# Altium schematic sheet Schematic.schdoc
size 297 x 209 mm; Symbol: Drawing-Symbol_A4; @Project Name: Anirban-s-Bicycle-Taillight; @Page Count: 1; @Update Date: 2026-09-04; @Create Date: 2026-09-04; @Schematic Name: Schematic1; @Page No: 1; @Page Name: P1; Company: EasyEDA.com; Version: V1.0; Page Size: A4; Device: Drawing-Symbol_A4; @Create Time: 11:02:27; @Update Time: 11:02:27; Border: 1; Width: 1170; Height: 825; Region Start: 1; X Region Count: 6; Y Region Count: 4; Blade Width: 10; Title Block Position: 3; @Board Name: Board1
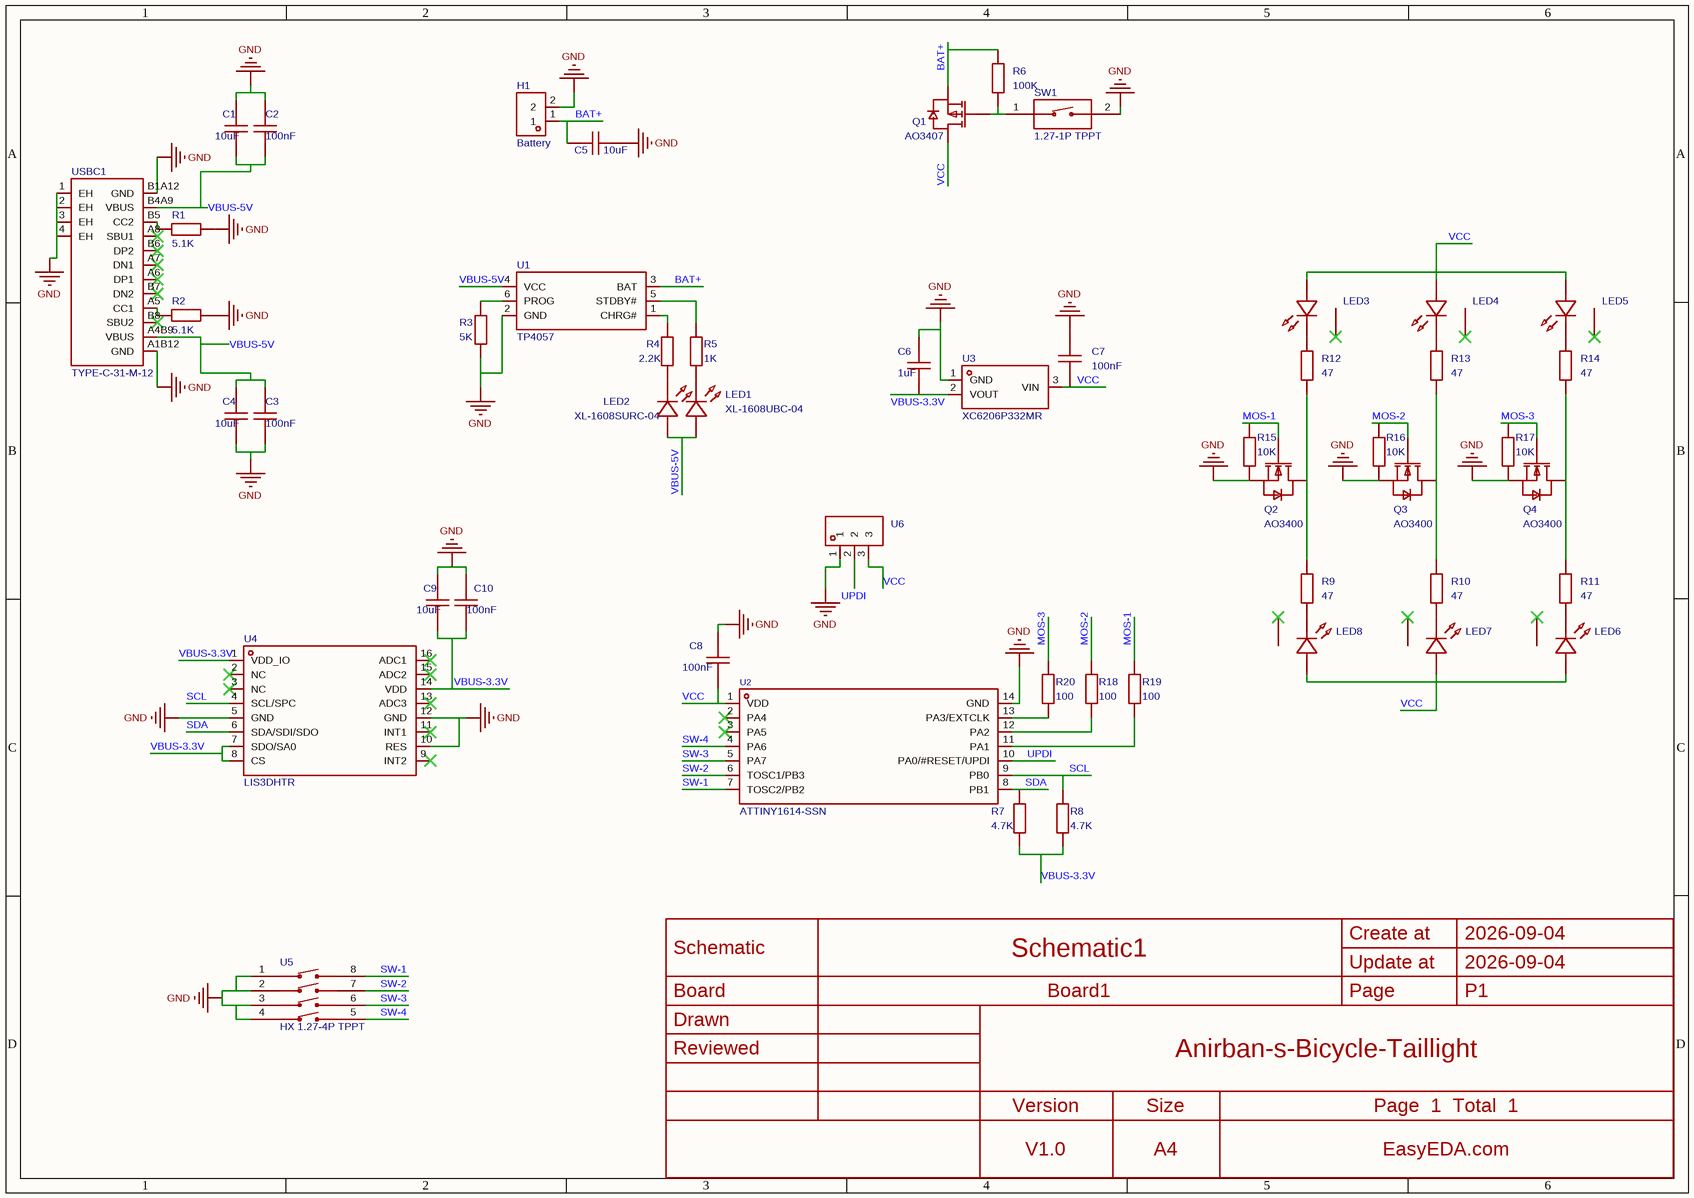
[diagram p0: Schematic.schdoc]

## Parts
C1  10uF  [C0603]
C2  100nF  [C0603]
C3  100nF  [C0603]
C4  10uF  [C0603]
C5  10uF  [C0603]
C6  1uF  [C0603]
C7  100nF  [C0603]
C8  100nF  [C0603]
C9  10uF  [C0603]
C10  100nF  [C0603]
H1  Battery  [HDR-TH_2P-P2.54-V-M]
LED1  XL-1608UBC-04  [LED0603-RD_BLUE]
LED2  XL-1608SURC-04  [LED0603-RD]
LED3  XL-5730SURC-05  [LED-SMD_XL-5730SURC-05]  (value not drawn)
LED4  XL-5730SURC-05  [LED-SMD_XL-5730SURC-05]  (value not drawn)
LED5  XL-5730SURC-05  [LED-SMD_XL-5730SURC-05]  (value not drawn)
LED6  XL-5730SURC-05  [LED-SMD_XL-5730SURC-05]  (value not drawn)
LED7  XL-5730SURC-05  [LED-SMD_XL-5730SURC-05]  (value not drawn)
LED8  XL-5730SURC-05  [LED-SMD_XL-5730SURC-05]  (value not drawn)
Q1  AO3407  [SOT-23-3_L2.9-W1.3-P1.90-LS2.4-BR]
Q2  AO3400  [SOT-23-3_L2.9-W1.3-P1.90-LS2.4-BR]
Q3  AO3400  [SOT-23-3_L2.9-W1.3-P1.90-LS2.4-BR]
Q4  AO3400  [SOT-23-3_L2.9-W1.3-P1.90-LS2.4-BR]
R1  value 5.1K  [R0603]
R2  value 5.1K  [R0603]
R3  5K  [R0603]
R4  2.2K  [R0603]
R5  1K  [R0603]
R6  100K  [R0603]
R7  4.7K  [R0603]
R8  4.7K  [R0603]
R9  47  [R0603]
R10  47  [R0603]
R11  47  [R0603]
R12  47  [R0603]
R13  47  [R0603]
R14  47  [R0603]
R15  10K  [R0603]
R16  10K  [R0603]
R17  10K  [R0603]
R18  100  [R0603]
R19  100  [R0603]
R20  100  [R0603]
SW1  1.27-1P TPPT  [SW-SMD_1.27-1P-TPPT]
U1  TP4057  [SOT-23-6_L2.9-W1.6-P0.95-LS2.9-BL]
U2  ATTINY1614-SSN  [SOIC-14_L8.7-W3.9-P1.27-LS6.0-BL]
U3  XC6206P332MR  [SOT-23-3_L2.9-W1.6-P1.90-LS2.8-BR]
U4  LIS3DHTR  [LGA-16_L3.0-W3.0-P0.50-TL]
U5  HX 1.27-4P TPPT  [SW-SMD_8P-P1.27-L6.7-W5.4]
U6  黄色排针A_HEADER3  [HDR-TH_3P-P2.54-V-M-1]  (value not drawn)
USBC1  TYPE-C-31-M-12  [USB-C_SMD-TYPE-C-31-M-12_1]

## Nets
GND: C1.1 C2.1 C3.1 C4.1 C5.2 C6.1 C7.1 C8.1 C9.1 C10.1 H1.2 Q2.2(S) Q3.2(S) Q4.2(S) R1.2 R2.2 R3.1 R15.1 R16.1 R17.1 SW1.2 U1.2(GND) U2.14(GND) U3.1(GND) U4.5(GND) U4.10(RES) U4.12(GND) U5.1 U5.2 U5.3 U5.4 U6.1 USBC1.1(EH) USBC1.2(EH) USBC1.3(EH) USBC1.4(EH) USBC1.A1B12(GND) USBC1.B1A12(GND)
BAT+: C5.1 H1.1 Q1.2(S) R6.2 U1.3(BAT)
MOS-1: Q2.1(G) R15.2 R19.2
MOS-2: Q3.1(G) R16.2 R18.2
MOS-3: Q4.1(G) R17.2 R20.2
SCL: R8.2 U2.9(PB0) U4.4(SCL/SPC)
SDA: R7.2 U2.8(PB1) U4.6(SDA/SDI/SDO)
SW-1: U2.7(TOSC2/PB2) U5.8
SW-2: U2.6(TOSC1/PB3) U5.7
SW-3: U2.5(PA7) U5.6
SW-4: U2.4(PA6) U5.5
UPDI: U2.10(PA0/#RESET/UPDI) U6.2
VBUS-3.3V: C6.2 C9.2 C10.2 R7.1 R8.1 U3.2(VOUT) U4.1(VDD_IO) U4.7(SDO/SA0) U4.8(CS) U4.14(VDD)
VBUS-5V: C1.2 C2.2 C3.2 C4.2 LED1.2(A) LED2.2(A) U1.4(VCC) USBC1.A4B9(VBUS) USBC1.B4A9(VBUS)
VCC: C7.2 C8.2 LED3.1 LED4.1 LED5.1 LED6.1 LED7.1 LED8.1 Q1.3(D) U2.1(VDD) U3.3(VIN) U6.3
NetLED1_1: LED1.1(K) R5.1
NetLED2_1: LED2.1(K) R4.1
NetLED3_2: LED3.2 R12.2
NetLED4_2: LED4.2 R13.2
NetLED5_2: LED5.2 R14.2
NetLED6_2: LED6.2 R11.1
NetLED7_2: LED7.2 R10.1
NetLED8_2: LED8.2 R9.1
NetQ1_1: Q1.1(G) R6.1 SW1.1
NetQ2_3: Q2.3(D) R9.2 R12.1
NetQ3_3: Q3.3(D) R10.2 R13.1
NetQ4_3: Q4.3(D) R11.2 R14.1
NetR1_1: R1.1 USBC1.B5(CC2)
NetR2_1: R2.1 USBC1.A5(CC1)
NetR3_2: R3.2 U1.6(PROG)
NetR4_2: R4.2 U1.1(CHRG#)
NetR5_2: R5.2 U1.5(STDBY#)
NetR18_1: R18.1 U2.12(PA2)
NetR19_1: R19.1 U2.11(PA1)
NetR20_1: R20.1 U2.13(PA3/EXTCLK)

Not connected (* = marked no-connect by the designer): LED3 3*; LED4 3*; LED5 3*; LED6 3*; LED7 3*; LED8 3*; U2 2(PA4)* 3(PA5)*; U4 2(NC)* 3(NC)* 9(INT2)* 11(INT1)* 13(ADC3)* 15(ADC2)* 16(ADC1)*; USBC1 A6(DP1)* A7(DN1)* A8(SBU1)* B6(DP2)* B7(DN2)* B8(SBU2)*

## Notes on the sheet
- Create at
- 2026-09-04
- Schematic
- Board
- Schematic1
- Board1
- Update at
- Page
- P1
- Drawn
- Reviewed
- Anirban-s-Bicycle-Taillight
- Version
- V1.0
- Size
- A4
- Page  1  Total  1
- EasyEDA.com

## Library data of the parts
C1-C4 = CAP_0603: Symbol: CAP_OLD; ConvertToPcb: yes; ModelId: 624118aa3cc7497086c383c2d72e08520819f05c4eef4c71ace90d822a990e87; ModelName: C0603_L1.6-W0.8-H0.8; ModelTransform: 62.992,31.496,0,0,0,0,0,0,0; Device: CAP_0603; AddInBom: yes; Supplier Footprint: 0603; FootprintName: C0603
  C1 C4: Value: 10uF
  C2 C3: Value: 100nF
C5-C10 = CAP_0603: Symbol: CAP_OLD; 3D Model: 624118aa3cc7497086c383c2d72e08520819f05c4eef4c71ace90d822a990e87; 3D Model Transform: 62.992,31.496,0,0,0,0,0,0,0; ConvertToPcb: yes; ModelName: C0603_L1.6-W0.8-H0.8; Device: CAP_0603; Supplier Footprint: 0603; AddInBom: yes; FootprintName: C0603
  C5 C9: Value: 10uF
  C6: Value: 1uF
  C7 C8 C10: Value: 100nF
H1 = PZ254V-11-02P: Pin Structure:1x2P Pitch:2.54mm Row Spacing:- Circluar Pins/Square Pins:Pin Header Mounting Type:Through Hole Number of Rows:1 Number of Pins:2P Current Rating:3A Voltage Rating (Max):250V Length of Mating Pin:6mm Insulation Height:2.5mm Length of End Con; Manufacturer: XFCN(兴飞); AddInBom: yes; ModelId: b9a02bffb1e248eabf92e8e2aa859dc00819f05c4eef4c71ace90d822a990e87; ModelName: HDR2.54-M-LI-1X2P; ModelTransform: 200,100,0,0,0,0,0,0,-118.11; Pin Structure: 1x2P; Pitch: 2.54mm; Current Rating: 3A; Voltage Rating (Max): 250V; Symbol: PZ254V-11-02P; Device: PZ254V-11-02P; Manufacturer Part: Battery; LCSC Part Name: 1x2P 间距:2.54mm 方针 直插; SupplierPart: C492401; Supplier Footprint: 插件,P=2.54mm; JLCPCB Part Class: Extended Part; Datasheet: https://item.szlcsc.com/datasheet/PZ254V-11-02P/502957.html; Supplier: LCSC; ConvertToPcb: yes; FootprintName: HDR-TH_2P-P2.54-V-M; Row Spacing: -; Circluar Pins/Square Pins: Pin Header; Mounting Type: Through Hole; Number of Rows: 1; Number of Pins: 2P; Length of Mating Pin: 6mm; Insulation Height: 2.5mm; Length of End Connection Pin: 3mm; Contact Material: Brass; Contact Plating: -; Operating Temperature: -40℃~+105℃; Color: Black
LED1 = XL-1608UBC-04: Lamp Holder Type:1.6mm x 0.8mm square LED Illumination Color:Blue Voltage - Forward(Vf):3.3V Voltage - Forward(Vf):3.3V Power(Watts):70mW Forward Current:20mA Wavelength - Dominant:455nm~475nm Wavelength - Dominant:455nm~475nm Peak Wavelength:470nm Peak W; Manufacturer: XINGLIGHT(成兴光); AddInBom: yes; ModelId: c855dcfa3bed47718ab34fb5ca38c90d0819f05c4eef4c71ace90d822a990e87; ModelTransform: 63.7794,31.496,0,0,0,0,0,0.002,0; Illumination Color: Blue; Voltage - Forward(Vf): 3.3V; Power(Watts): 70mW; Forward Current: 20mA; Peak Wavelength: 470nm; Diode Configuration: Discrete Diode; Lens Color: Water Clear; Luminous Intensity: 300mcd; Viewing Angle: 120°; Symbol: XL-1608UBC-04; Device: XL-1608UBC-04; LCSC Part Name: 0603蓝色贴片式发光二极管; SupplierPart: C965807; ManufacturerPart: XL-1608UBC-04; Supplier Footprint: 0603; JLCPCB Part Class: Extended Part; Datasheet: https://item.szlcsc.com/datasheet/XL-1608UBC-04/1051416.html; Supplier: LCSC; ConvertToPcb: yes; FootprintName: LED0603-RD_BLUE; ModelName: LED0603-RD_BLUE; Lamp Holder Type: 1.6mm x 0.8mm square LED; Wavelength - Dominant: 455nm~475nm; Color Temperature: -; Mounting Style: Top-mount; Operating Temperature: -40℃~+85℃
LED2 = XL-1608SURC-04: Lamp Holder Type:1.6mm x 0.8mm square LED Illumination Color:Red Voltage - Forward(Vf):2.4V Voltage - Forward(Vf):2.4V Power(Watts):50mW Forward Current:20mA Wavelength - Dominant:620nm~625nm Wavelength - Dominant:620nm~625nm Peak Wavelength:625nm Peak Wa; Manufacturer: XINGLIGHT(成兴光); AddInBom: yes; ModelId: 5e3b568068dd46cf8019c1d1baa0031b0819f05c4eef4c71ace90d822a990e87; ModelTransform: 63.7794,32.283,0,0,0,0,0,0,0; Illumination Color: Red; Voltage - Forward(Vf): 2.4V; Power(Watts): 50mW; Forward Current: 20mA; Peak Wavelength: 625nm; Diode Configuration: Discrete Diode; Lens Color: Water Clear; Luminous Intensity: 120mcd; Viewing Angle: 120°; Symbol: XL-1608SURC-04; Device: XL-1608SURC-04; LCSC Part Name: 0603红色贴片式发光二极管; SupplierPart: C965798; ManufacturerPart: XL-1608SURC-04; Supplier Footprint: 0603; JLCPCB Part Class: Extended Part; Datasheet: https://item.szlcsc.com/datasheet/XL-1608SURC-04/1051407.html; Supplier: LCSC; ConvertToPcb: yes; FootprintName: LED0603-RD; ModelName: LED0603-RD; Lamp Holder Type: 1.6mm x 0.8mm square LED; Wavelength - Dominant: 620nm~625nm; Color Temperature: -; Mounting Style: Top-mount; Operating Temperature: -40℃~+85℃
LED3-LED8 = XL-5730SURC-05: Lamp Holder Type:5.7mmx3.0mm方形灯头 Illumination Color:Red Voltage - Forward(Vf):2.4V Voltage - Forward(Vf):2.4V Power(Watts):500mW Forward Current:150mA Wavelength - Dominant:620nm~630nm Wavelength - Dominant:620nm~630nm Peak Wavelength:625nm Peak Wavelengt; Manufacturer: XINGLIGHT(成兴光); AddInBom: yes; ModelId: baeed070cb034912b15d57249944bc550819f05c4eef4c71ace90d822a990e87; ModelTransform: 224.409,118.11,0,0,0,0,0,0,0; Illumination Color: Red; Voltage - Forward(Vf): 2.4V; Power(Watts): 500mW; Forward Current: 150mA; Peak Wavelength: 625nm; Diode Configuration: Discrete Diode; Lens Color: Water Clear; Viewing Angle: 120°; Symbol: XL-5730SURC-05; Device: XL-5730SURC-05; LCSC Part Name: 贴片式发光二极管; SupplierPart: C2843883; ManufacturerPart: XL-5730SURC-05; Supplier Footprint: SMD5730-3P; JLCPCB Part Class: Extended Part; Datasheet: https://item.szlcsc.com/datasheet/XL-5730SURC-05/3033184.html; Supplier: LCSC; ConvertToPcb: yes; FootprintName: LED-SMD_XL-5730SURC-05; ModelName: LED-SMD_XL-5730SURC-05; Lamp Holder Type: 5.7mmx3.0mm方形灯头; Wavelength - Dominant: 620nm~630nm; Color Temperature: -; Luminous Intensity: -; Mounting Style: Top-mount; Operating Temperature: -20℃~+80℃
Q1 = AO3407_C54863558: Manufacturer: SEP(威旺); AddInBom: yes; ModelId: 62a57c6760504a01965db6419a6d07df0819f05c4eef4c71ace90d822a990e87; ModelName: SOT-23-3P_L2.9-W1.3-H1.0-LS2.4-P0.95; ModelTransform: 98.425,114.173,0,180,0,0,0.0005,-0.0005,0; Symbol: AO3407_C54863558; Device: AO3407_C54863558; LCSC Part Name: AO3407; SupplierPart: C54863558; ManufacturerPart: AO3407; Supplier Footprint: SOT-23; JLCPCB Part Class: Extended Part; Datasheet: https://item.szlcsc.com/datasheet/AO3407/58359818.html; Supplier: LCSC; ConvertToPcb: yes; FootprintName: SOT-23-3_L2.9-W1.3-P1.90-LS2.4-BR
Q2-Q4 = AO3400_C51315085: Number:1 N-channel Drain to Source Voltage:30V Current - Continuous Drain(Id):5.8A RDS(on):35mΩ@10V Pd - Power Dissipation:350mW Gate Threshold Voltage (Vgs(th)):1.4V Gate Charge(Qg):- Input Capacitance(Ciss):1.05nF Reverse Transfer Capacitance (Crss@Vds); Manufacturer: CBI(创基); AddInBom: yes; ModelId: 62a57c6760504a01965db6419a6d07df0819f05c4eef4c71ace90d822a990e87; ModelName: SOT-23-3P_L2.9-W1.3-H1.0-LS2.4-P0.95; ModelTransform: 98.425,114.173,0,180,0,0,0.0005,-0.0005,0; Drain to Source Voltage: 30V; Current - Continuous Drain(Id): 5.8A; Pd - Power Dissipation: 350mW; Gate Threshold Voltage (Vgs(th)): 1.4V; Input Capacitance(Ciss): 1.05nF; Reverse Transfer Capacitance (Crss@Vds): 77pF; Output Capacitance(Coss): 99pF; Vgs: ±12V; Symbol: AO3400_C51315085; Device: AO3400_C51315085; LCSC Part Name: SOT-23封装N沟道增强型场效应塑料封装MOSFET，高密单元设计，低导通电阻，具备出色导通电阻和最大直流电流能力; SupplierPart: C51315085; ManufacturerPart: AO3400; Supplier Footprint: SOT-23; JLCPCB Part Class: Extended Part; Datasheet: https://item.szlcsc.com/datasheet/AO3400/53967173.html; Supplier: LCSC; ConvertToPcb: yes; FootprintName: SOT-23-3_L2.9-W1.3-P1.90-LS2.4-BR; Number: 1 N-channel; RDS(on): 35mΩ@10V; Gate Charge(Qg): -; Operating Temperature: -; Configuration: -; Type: N-Channel
R1-R5 = Res_0603: Symbol: Res; ConvertToPcb: yes; ModelId: 112863783b5b41f1b5254f87eedc79320819f05c4eef4c71ace90d822a990e87; ModelTransform: 31.8897,63.7794,0,90,0,0,0,0,0; Device: Res_0603; AddInBom: yes; Supplier Footprint: 0603; FootprintName: R0603; ModelName: R0603
  R3: Value: 5K
  R4: Value: 2.2K
  R5: Value: 1K
R6-R20 = Res_0603: Symbol: Res; 3D Model: 112863783b5b41f1b5254f87eedc79320819f05c4eef4c71ace90d822a990e87; 3D Model Transform: 31.8897,63.7794,0,90,0,0,0,0,0; ConvertToPcb: yes; Device: Res_0603; Supplier Footprint: 0603; AddInBom: yes; FootprintName: R0603; ModelName: R0603
  R6: Value: 100K
  R7 R8: Value: 4.7K
  R9-R14: Value: 47
  R15-R17: Value: 10K
  R18-R20: Value: 100
SW1 = 1.27-1P TPPT: Type:Slide, Recessed Circuit:SPST Number of Positions:1 Termination Style:Gull Wing Lead Pitch:1.27mm Current Rating:25mA Voltage Rating:24V Operating Temperature:-30℃~+85℃ Operating Temperature:-30℃~+85℃ Operating Life:2,000 cycles Color:Black; Manufacturer: SHOU HAN(首韩); AddInBom: yes; ModelId: 38b659ad1ea6435a942904584f367d4a0819f05c4eef4c71ace90d822a990e87; ModelTransform: 112.9919,328.7395,0,0,0,0,0,0,0; Circuit: SPST; Number of Positions: 1; Current Rating: 25mA; Voltage Rating: 24V; Symbol: 1.27-1P TPPT; Device: 1.27-1P TPPT; LCSC Part Name: 1.27-1P贴片平推有LOGO贴膜编带; SupplierPart: C6386918; ManufacturerPart: 1.27-1P TPPT; Supplier Footprint: SMD,P=1.27mm; JLCPCB Part Class: Extended Part; Datasheet: https://item.szlcsc.com/datasheet/1.27-1P%2520TPPT/7337475.html; Supplier: LCSC; ConvertToPcb: yes; FootprintName: SW-SMD_1.27-1P-TPPT; ModelName: SW-SMD_1.27-1P-TPPT; Type: Slide, Recessed; Termination Style: Gull Wing; Lead Pitch: 1.27mm; Operating Temperature: -30℃~+85℃; Operating Life: 2,000 cycles; Color: Black
U1 = TP4057_C18198383: The Chip Type:Charging IC Voltage - Supply:4.25V~6.5V Voltage - Supply:4.25V~6.5V Charge Current - Max:500mA Charging Saturation Voltage:4.2V End-Off Voltage:- Type of Battery:Lithium Battery Number of Cells:1 Number of Cells:1 Operating Temperature:-40℃~; Manufacturer: HXY MOSFET(华轩阳电子); AddInBom: yes; ModelId: 2643a280c6074a1bbaee88508a1815ee0819f05c4eef4c71ace90d822a990e87; ModelTransform: 114.173,114.173,0,0,0,0,0,0,0; Charge Current - Max: 500mA; Charging Saturation Voltage: 4.2V; Number of Cells: 1; Battery Temperature Detection: Not supported; Supply Current (Iq): 25uA; Symbol: TP4057_C18198383; Device: TP4057_C18198383; LCSC Part Name: 电池管理 500mA; SupplierPart: C18198383; ManufacturerPart: TP4057; Supplier Footprint: SOT-23-6L; JLCPCB Part Class: Extended Part; Datasheet: https://item.szlcsc.com/datasheet/TP4057/19350041.html; Supplier: LCSC; ConvertToPcb: yes; FootprintName: SOT-23-6_L2.9-W1.6-P0.95-LS2.9-BL; ModelName: SOT-23-6_L2.9-W1.6-P0.95-LS2.9-BL; The Chip Type: Charging IC; Voltage - Supply: 4.25V~6.5V; End-Off Voltage: -; Type of Battery: Lithium Battery; Operating Temperature: -40℃~+85℃; 0V Battery Charge: Not supported; Balance Current: -; Interface: -; Features: Constant voltage charging；Constant current charging；Automatic recharge；Charge termination；Soft start；Programmable charging current；Undervoltage lockout；Trickle charging
U2 = ATTINY1614-SSN_C614832: CPU Core:AVR CPU Maximum Speed:20MHz Program Storage Size:16KB Number of I/O:12 ADC (Bit):10bit DAC (Bit):8bit Voltage - Supply:1.8V~5.5V Voltage - Supply:1.8V~5.5V Applications:-; Manufacturer: MICROCHIP(美国微芯); AddInBom: yes; ModelId: 4a4abff9a5634443a503282266e866970819f05c4eef4c71ace90d822a990e87; ModelName: SOIC-14_L8.6-W3.9-H1.8-LS6.0-P1.27; ModelTransform: 338.583,236.22,0,0,0,0,0,0.001,0; CPU Core: AVR; CPU Maximum Speed: 20MHz; Program Storage Size: 16KB; Number of I/O: 12; ADC (Bit): 10bit; DAC (Bit): 8bit; Symbol: ATTINY1614-SSN_C614832; Device: ATTINY1614-SSN_C614832; Supplier: LCSC; Supplier Part: C614832; Manufacturer Part: ATTINY1614-SSN; JLCPCB Part Class: Extended Part; LCSC Part Name: ATTINY1614-SSN; Supplier Footprint: SOIC-14; Datasheet: https://item.szlcsc.com/datasheet/ATTINY1614-SSN/644840.html; ConvertToPcb: yes; FootprintName: SOIC-14_L8.7-W3.9-P1.27-LS6.0-BL; Voltage - Supply: 1.8V~5.5V; Applications: -
U3 = XC6206P332MR_C51886221: Output Configuration:Positive Voltage - Supply:6V Output Voltage:3.3V Output Voltage:3.3V Output Current:100mA Power Supply Rejection Ratio (PSRR):45dB@(1kHz) Voltage Dropout:160mV@(50mA) standby current:6uA Noise:- Features:Over Current Protection；Therma; Manufacturer: TECH PUBLIC(台舟); AddInBom: yes; ModelId: 4eed685bb9f4439b846746bc2193f3c00819f05c4eef4c71ace90d822a990e87; ModelName: SOT-23-3L_L2.9-W1.6-H1.1-LS2.8-P0.95; ModelTransform: 114.173,110.236,0,90,0,0,0,0,0; Voltage - Supply: 6V; Output Voltage: 3.3V; Output Current: 100mA; standby current: 6uA; Output Type: Fixed; Number of Outputs: 1; Symbol: XC6206P332MR_C51886221; Device: XC6206P332MR_C51886221; LCSC Part Name: 3.3V 6V; SupplierPart: C51886221; ManufacturerPart: XC6206P332MR; Supplier Footprint: SOT-23; JLCPCB Part Class: Extended Part; Datasheet: https://item.szlcsc.com/datasheet/XC6206P332MR/54557107.html; Supplier: LCSC; ConvertToPcb: yes; FootprintName: SOT-23-3_L2.9-W1.6-P1.90-LS2.8-BR; Output Configuration: Positive; Power Supply Rejection Ratio (PSRR): 45dB@(1kHz); Voltage Dropout: 160mV@(50mA); Noise: -; Features: Over Current Protection；Thermal shutdown; Operating Temperature: -40℃~+125℃
U4 = LIS3DHTR: Accelerometer Sensing Axis:X,Y,Z Acceleration Measurement Range (MAX):±16g Acceleration Measurement Range (MAX):±16g Gyroscope Sensing Axis:- Gyroscope Measurement Range (MAX):- Gyroscope Measurement Range (MAX):- Sensor Type:Accelerometer Output Bits:16b; Manufacturer: ST(意法半导体); Symbol: LIS3DHTR_C15134; AddInBom: yes; ModelId: 4f77563cd9cf46379f45c1990dd6f43a0819f05c4eef4c71ace90d822a990e87; ModelTransform: 118.11,118.11,0,0,0,0,0,0,0; Accelerometer Sensing Axis: X,Y,Z; Acceleration Measurement Range (MAX): ±16g; Output Bits: 16bit; Interface: I2C；SPI; Voltage - Supply: 1.71V~3.6V; Standby Current: 500nA; Device: LIS3DHTR; LCSC Part Name: MEMS数字输出运动传感器：超低功耗、高性能三轴加速度计; SupplierPart: C15134; ManufacturerPart: LIS3DHTR; Supplier Footprint: LGA-16(3x3); JLCPCB Part Class: Extended Part; Datasheet: https://item.szlcsc.com/datasheet/LIS3DHTR/15808.html; Supplier: LCSC; ConvertToPcb: yes; FootprintName: LGA-16_L3.0-W3.0-P0.50-TL; ModelName: LGA-16_L3.0-W3.0-P0.50-TL; Gyroscope Sensing Axis: -; Gyroscope Measurement Range (MAX): -; Sensor Type: Accelerometer; Cache Size: -; Operating Temperature: -40℃~+85℃; Features: Motion event detection
U5 = HX 1.27-4P TPPT: Type:Slide, Recessed Circuit:SPST Number of Positions:4 Termination Style:- Lead Pitch:1.27mm Current Rating:25mA Voltage Rating:24V Operating Temperature:-30℃~+85℃ Operating Temperature:-30℃~+85℃ Operating Life:2,000 Cycles Color:Black; Manufacturer: hanxia(韩下); AddInBom: yes; ModelId: 83c016bef41a4e07b861d37e08ddd85d0819f05c4eef4c71ace90d822a990e87; ModelTransform: 262.5979,328.7395,0,0,0,0,0.001,-0.003,0; Circuit: SPST; Number of Positions: 4; Current Rating: 25mA; Voltage Rating: 24V; Symbol: HX 1.27-4P TPPT; Device: HX 1.27-4P TPPT; LCSC Part Name: 拨码开关 贴片平拨 4位 1.27间距; SupplierPart: C7430300; ManufacturerPart: HX 1.27-4P TPPT; Supplier Footprint: SMD,P=1.27mm; JLCPCB Part Class: Extended Part; Datasheet: https://item.szlcsc.com/datasheet/HX%25201.27-4P%2520TPPT/8429924.html; Supplier: LCSC; ConvertToPcb: yes; FootprintName: SW-SMD_8P-P1.27-L6.7-W5.4; ModelName: SW-SMD_8P-P1.27-L6.7-W5.4; Type: Slide, Recessed; Termination Style: -; Lead Pitch: 1.27mm; Operating Temperature: -30℃~+85℃; Operating Life: 2,000 Cycles; Color: Black
U6 = 黄色排针A_HEADER3: AddInBom: yes; ModelId: 3b8cf4ff435f4f2b912293f2932d05980819f05c4eef4c71ace90d822a990e87; ModelName: HDR-M-2.54_1x3; ModelTransform: 299.9994,100,0,0,0,0,0,0,-118.11; Symbol: 黄色排针A_HEADER3; Device: 黄色排针A_HEADER3; LCSC Part Name: 黄色排针A_HEADER3; SupplierPart: C9900019266; ManufacturerPart: 黄色排针A_HEADER3; Supplier Footprint: HDR1X3_254M; JLCPCB Part Class: Extended Part; Supplier: LCSC; ConvertToPcb: yes; FootprintName: HDR-TH_3P-P2.54-V-M-1
USBC1 = TYPE-C-31-M-12: Connector Type:Type-C Protocol Standard:- Gender:Female Mounting Type:Surface Mount, Right Angle Number of Contacts:16P Number of Ports:1 Current Rating-Power:5A Voltage Rating:20V Connect-Disconnect Life:10,000 cycles Length:7.35mm Operating Temperature:; Manufacturer: 韩国韩荣; AddInBom: yes; ModelId: 8421221a464047838322348b3a9debc30819f05c4eef4c71ace90d822a990e87; ModelTransform: 351.9678,311.023,0,180,0,0,0,-43.307,-33.465; Connector Type: Type-C; Gender: Female; Number of Contacts: 16P; Number of Ports: 1; Current Rating-Power: 5A; Voltage Rating: 20V; Symbol: TYPE-C-31-M-12; Device: TYPE-C-31-M-12; LCSC Part Name: Type-C 母 卧贴; SupplierPart: C165948; ManufacturerPart: TYPE-C-31-M-12; Supplier Footprint: SMD; JLCPCB Part Class: Extended Part; Datasheet: https://item.szlcsc.com/datasheet/TYPE-C-31-M-12/177331.html; Supplier: LCSC; ConvertToPcb: yes; FootprintName: USB-C_SMD-TYPE-C-31-M-12_1; ModelName: USB-C_SMD-TYPE-C-31-M-12_1; Protocol Standard: -; Mounting Type: Surface Mount, Right Angle; Connect-Disconnect Life: 10,000 cycles; Length: 7.35mm; Operating Temperature: -30℃~+80℃